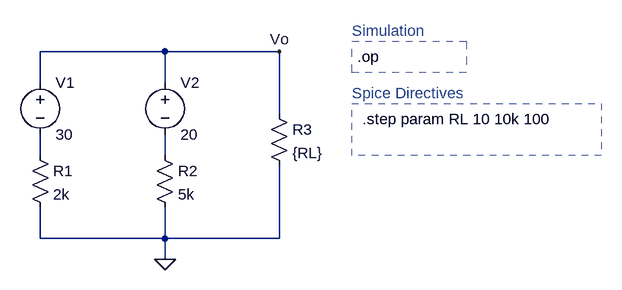
[diagram p0: schematic Variable_Param_MaxTransfer.asc]
Variable_Param_MaxTransfer.asc, the LTspice schematic file:
Version 4
SHEET 1 1432 696
WIRE 352 80 160 80
WIRE 528 80 352 80
WIRE 160 128 160 80
WIRE 352 128 352 80
WIRE 528 176 528 80
WIRE 160 240 160 208
WIRE 352 240 352 208
WIRE 160 368 160 320
WIRE 352 368 352 320
WIRE 352 368 160 368
WIRE 528 368 528 256
WIRE 528 368 352 368
WIRE 352 400 352 368
FLAG 352 400 0
FLAG 528 80 Vo
SYMBOL voltage 160 112 R0
SYMATTR InstName V1
SYMATTR Value 30
SYMBOL voltage 352 112 R0
SYMATTR InstName V2
SYMATTR Value 20
SYMBOL res 144 224 R0
SYMATTR InstName R1
SYMATTR Value 2k
SYMBOL res 336 224 R0
SYMATTR InstName R2
SYMATTR Value 5k
SYMBOL res 512 160 R0
SYMATTR InstName R3
SYMATTR Value {RL}
TEXT 640 48 Left 2 ;Simulation
TEXT 656 184 Left 2 !.step param RL 10 10k 100
TEXT 648 88 Left 2 !.op
TEXT 640 144 Left 2 ;Spice Directives
RECTANGLE Normal 816 112 640 64 2
RECTANGLE Normal 1024 240 640 160 2

The netlist it stands for:
* Variable_Param_MaxTransfer.asc
V1 Vo N001 30
V2 Vo N002 20
R1 N001 0 2k
R2 N002 0 5k
R3 Vo 0 {RL}
* Simulation
.step param RL 10 10k 100
.op
* Spice Directives
.backanno
.end